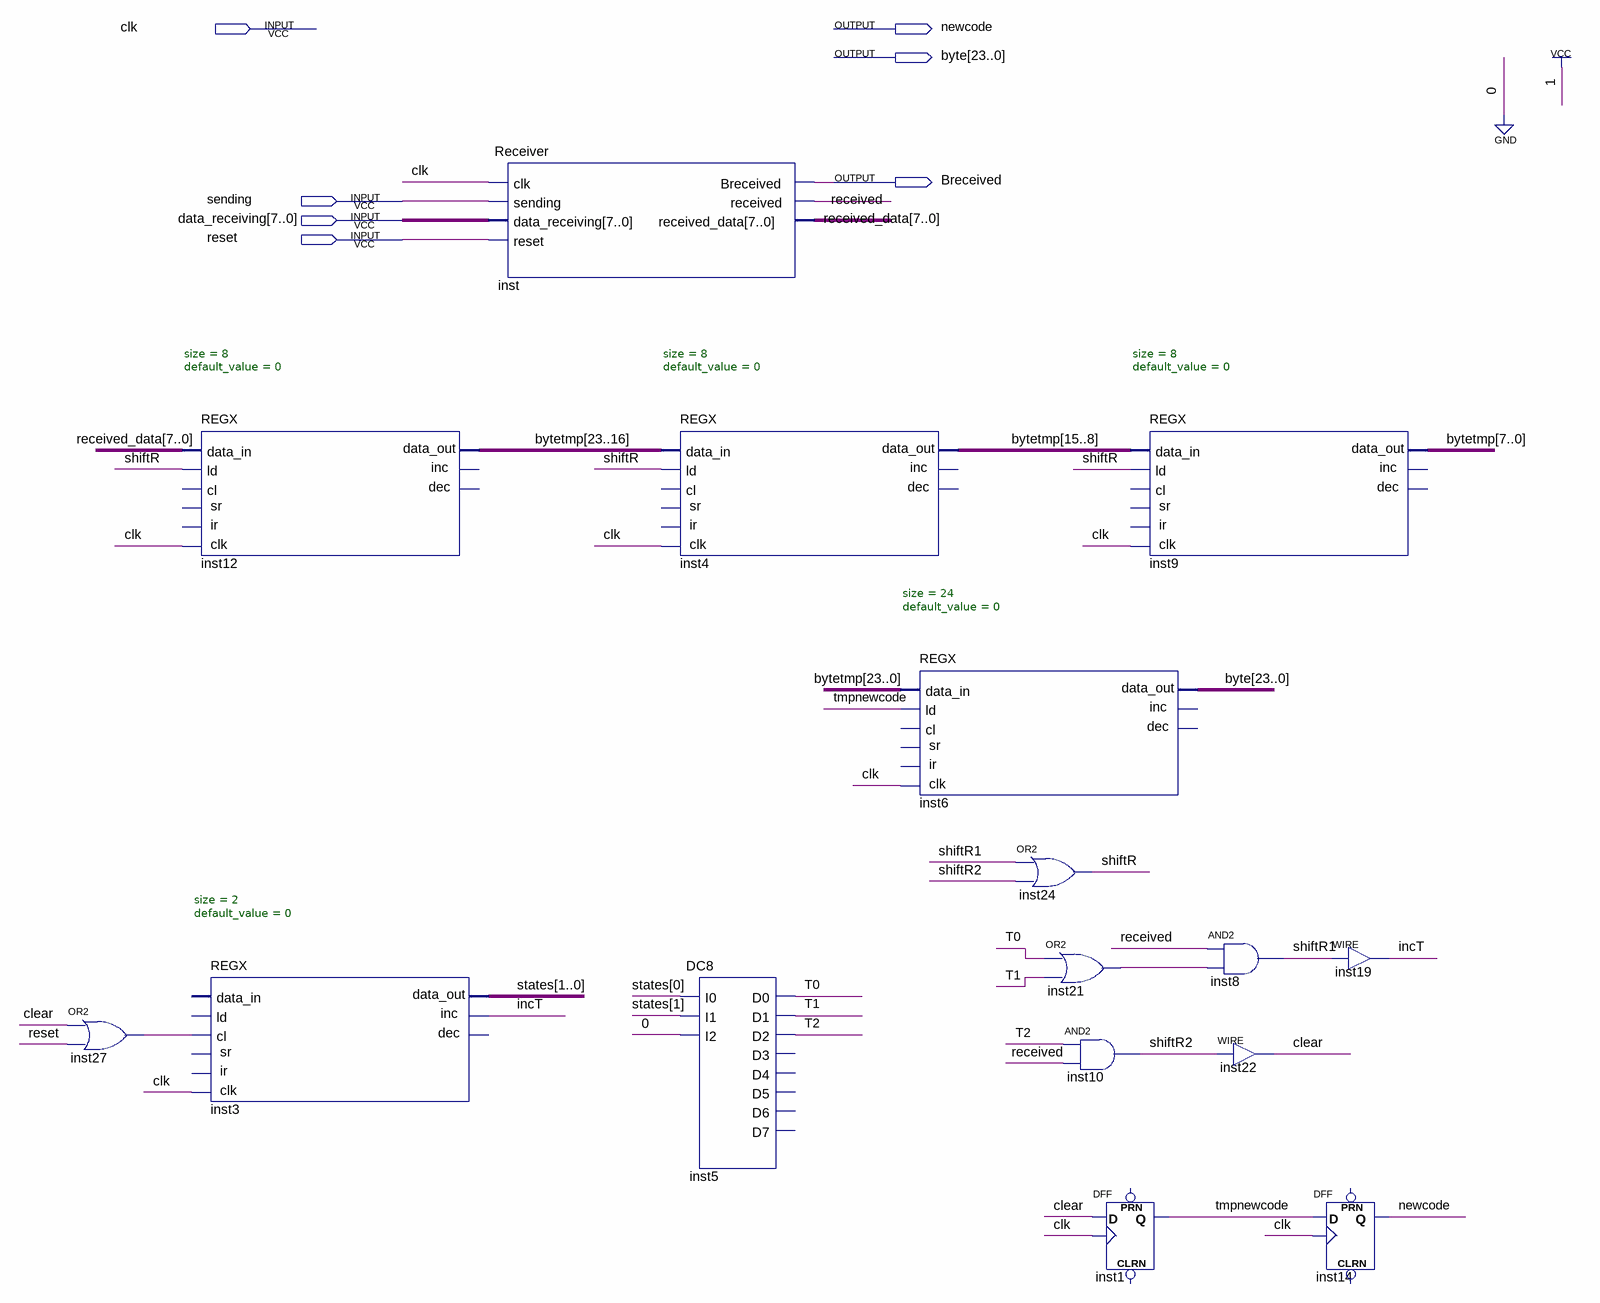
[diagram p0: schematic sheet]
// Quartus schematic PS2Receiver.bdf as structural Verilog: 16 symbols, 7 pins
module PS2Receiver (
  input  clk,
  input  sending,
  input  [7:0] data_receiving,
  input  reset,
  output newcode,
  output [23:0] \byte ,
  output Breceived
);

  wire clear, incT, inst21_out, inst27_out, received, shiftR, shiftR1, shiftR2, T0, T1, T2, tmpnewcode;
  wire [1:0] states;
  wire [7:0] received_data;
  wire [23:0] bytetmp;

  or inst27 (inst27_out, clear, reset);
  REGX #(.size(8), .default_value(0)) inst12 (
    .clk(clk), .ld(shiftR), .data_in(received_data), .data_out(bytetmp[23:16]));  // open: cl, inc, dec, sr, ir
  REGX #(.size(2), .default_value(0)) inst3 (
    .clk(clk), .cl(inst27_out), .inc(incT), .data_out(states));  // open: ld, dec, sr, ir, data_in
  Receiver inst (
    .clk(clk), .sending(sending), .data_receiving(data_receiving), .reset(reset), .Breceived(Breceived),
    .received(received), .received_data(received_data));
  REGX #(.size(8), .default_value(0)) inst4 (
    .clk(clk), .ld(shiftR), .data_in(bytetmp[23:16]), .data_out(bytetmp[15:8]));  // open: cl, inc, dec, sr, ir
  DC8 inst5 (.I0(states[0]), .I1(states[1]), .I2(1'b0), .D0(T0), .D1(T1), .D2(T2));  // open: D3, D4, D5, D6, D7
  REGX #(.size(24), .default_value(0)) inst6 (
    .clk(clk), .ld(tmpnewcode), .data_in(bytetmp), .data_out(\byte ));  // open: cl, inc, dec, sr, ir
  or inst24 (shiftR, shiftR1, shiftR2);
  or inst21 (inst21_out, T0, T1);
  and inst10 (shiftR2, T2, received);
  REGX #(.size(8), .default_value(0)) inst9 (
    .clk(clk), .ld(shiftR), .data_in(bytetmp[15:8]), .data_out(bytetmp[7:0]));  // open: cl, inc, dec, sr, ir
  DFF inst1 (.CLK(clk), .D(clear), .Q(tmpnewcode));  // open: CLRN, PRN
  and inst8 (shiftR1, received, inst21_out);
  assign clear = shiftR2;  // WIRE inst22
  assign incT = shiftR1;  // WIRE inst19
  DFF inst14 (.CLK(clk), .D(tmpnewcode), .Q(newcode));  // open: CLRN, PRN
endmodule
